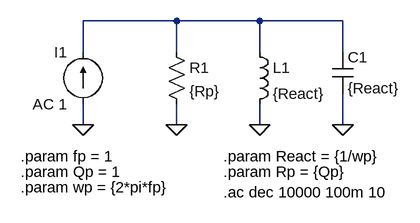
[diagram p0: schematic RLC Paralelo.asc]
RLC Paralelo.asc, the LTspice schematic file:
Version 4
SHEET 1 880 680
WIRE -64 64 -208 64
WIRE 64 64 -64 64
WIRE 192 64 64 64
WIRE -208 112 -208 64
WIRE -64 112 -64 64
WIRE 64 112 64 64
WIRE 192 112 192 64
WIRE -208 224 -208 192
WIRE -64 224 -64 192
WIRE 64 224 64 192
WIRE 192 224 192 176
FLAG -208 224 0
FLAG -64 224 0
FLAG 64 224 0
FLAG 192 224 0
SYMBOL current -208 192 R180
WINDOW 0 24 80 Left 2
WINDOW 3 24 0 Left 2
SYMATTR InstName I1
SYMATTR Value AC 1
SYMBOL res -80 96 R0
SYMATTR InstName R1
SYMATTR Value {Rp}
SYMBOL ind 48 96 R0
SYMATTR InstName L1
SYMATTR Value {React}
SYMBOL cap 176 112 R0
SYMATTR InstName C1
SYMATTR Value {React}
TEXT -304 272 Left 2 !.param fp = 1
TEXT -304 296 Left 2 !.param Qp = 1
TEXT -304 320 Left 2 !.param wp = {2*pi*fp}
TEXT 8 272 Left 2 !.param React = {1/wp}
TEXT 8 296 Left 2 !.param Rp = {Qp}
TEXT 8 328 Left 2 !.ac dec 10000 100m 10

The netlist it stands for:
* RLC Paralelo.asc
I1 0 N001 AC 1
R1 N001 0 {Rp}
L1 N001 0 {React}
C1 N001 0 {React}
.param fp = 1
.param Qp = 1
.param wp = {2*pi*fp}
.param React = {1/wp}
.param Rp = {Qp}
.ac dec 10000 100m 10
.backanno
.end